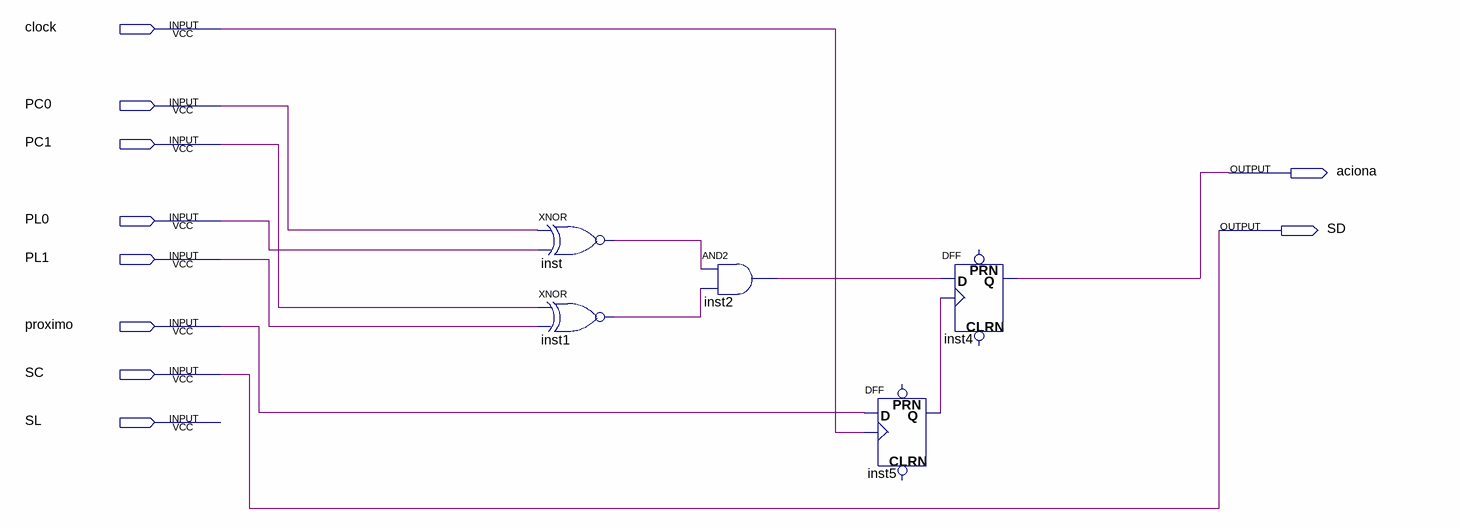
[diagram p0: schematic sheet]
// Quartus schematic fluxo_de_dados.bdf as structural Verilog: 5 symbols, 10 pins
module fluxo_de_dados (
  input  clock,
  input  PC0,
  input  PC1,
  input  PL0,
  input  PL1,
  input  proximo,
  input  SC,
  input  SL,
  output aciona,
  output SD
);

  wire inst1_out, inst2_out, inst5_q, inst_out;

  xnor inst (inst_out, PC0, PL0);
  xnor inst1 (inst1_out, PC1, PL1);
  and inst2 (inst2_out, inst_out, inst1_out);
  DFF inst5 (.CLK(clock), .D(proximo), .Q(inst5_q));  // open: CLRN, PRN
  DFF inst4 (.CLK(inst5_q), .D(inst2_out), .Q(aciona));  // open: CLRN, PRN

  assign SD = SC;
endmodule
